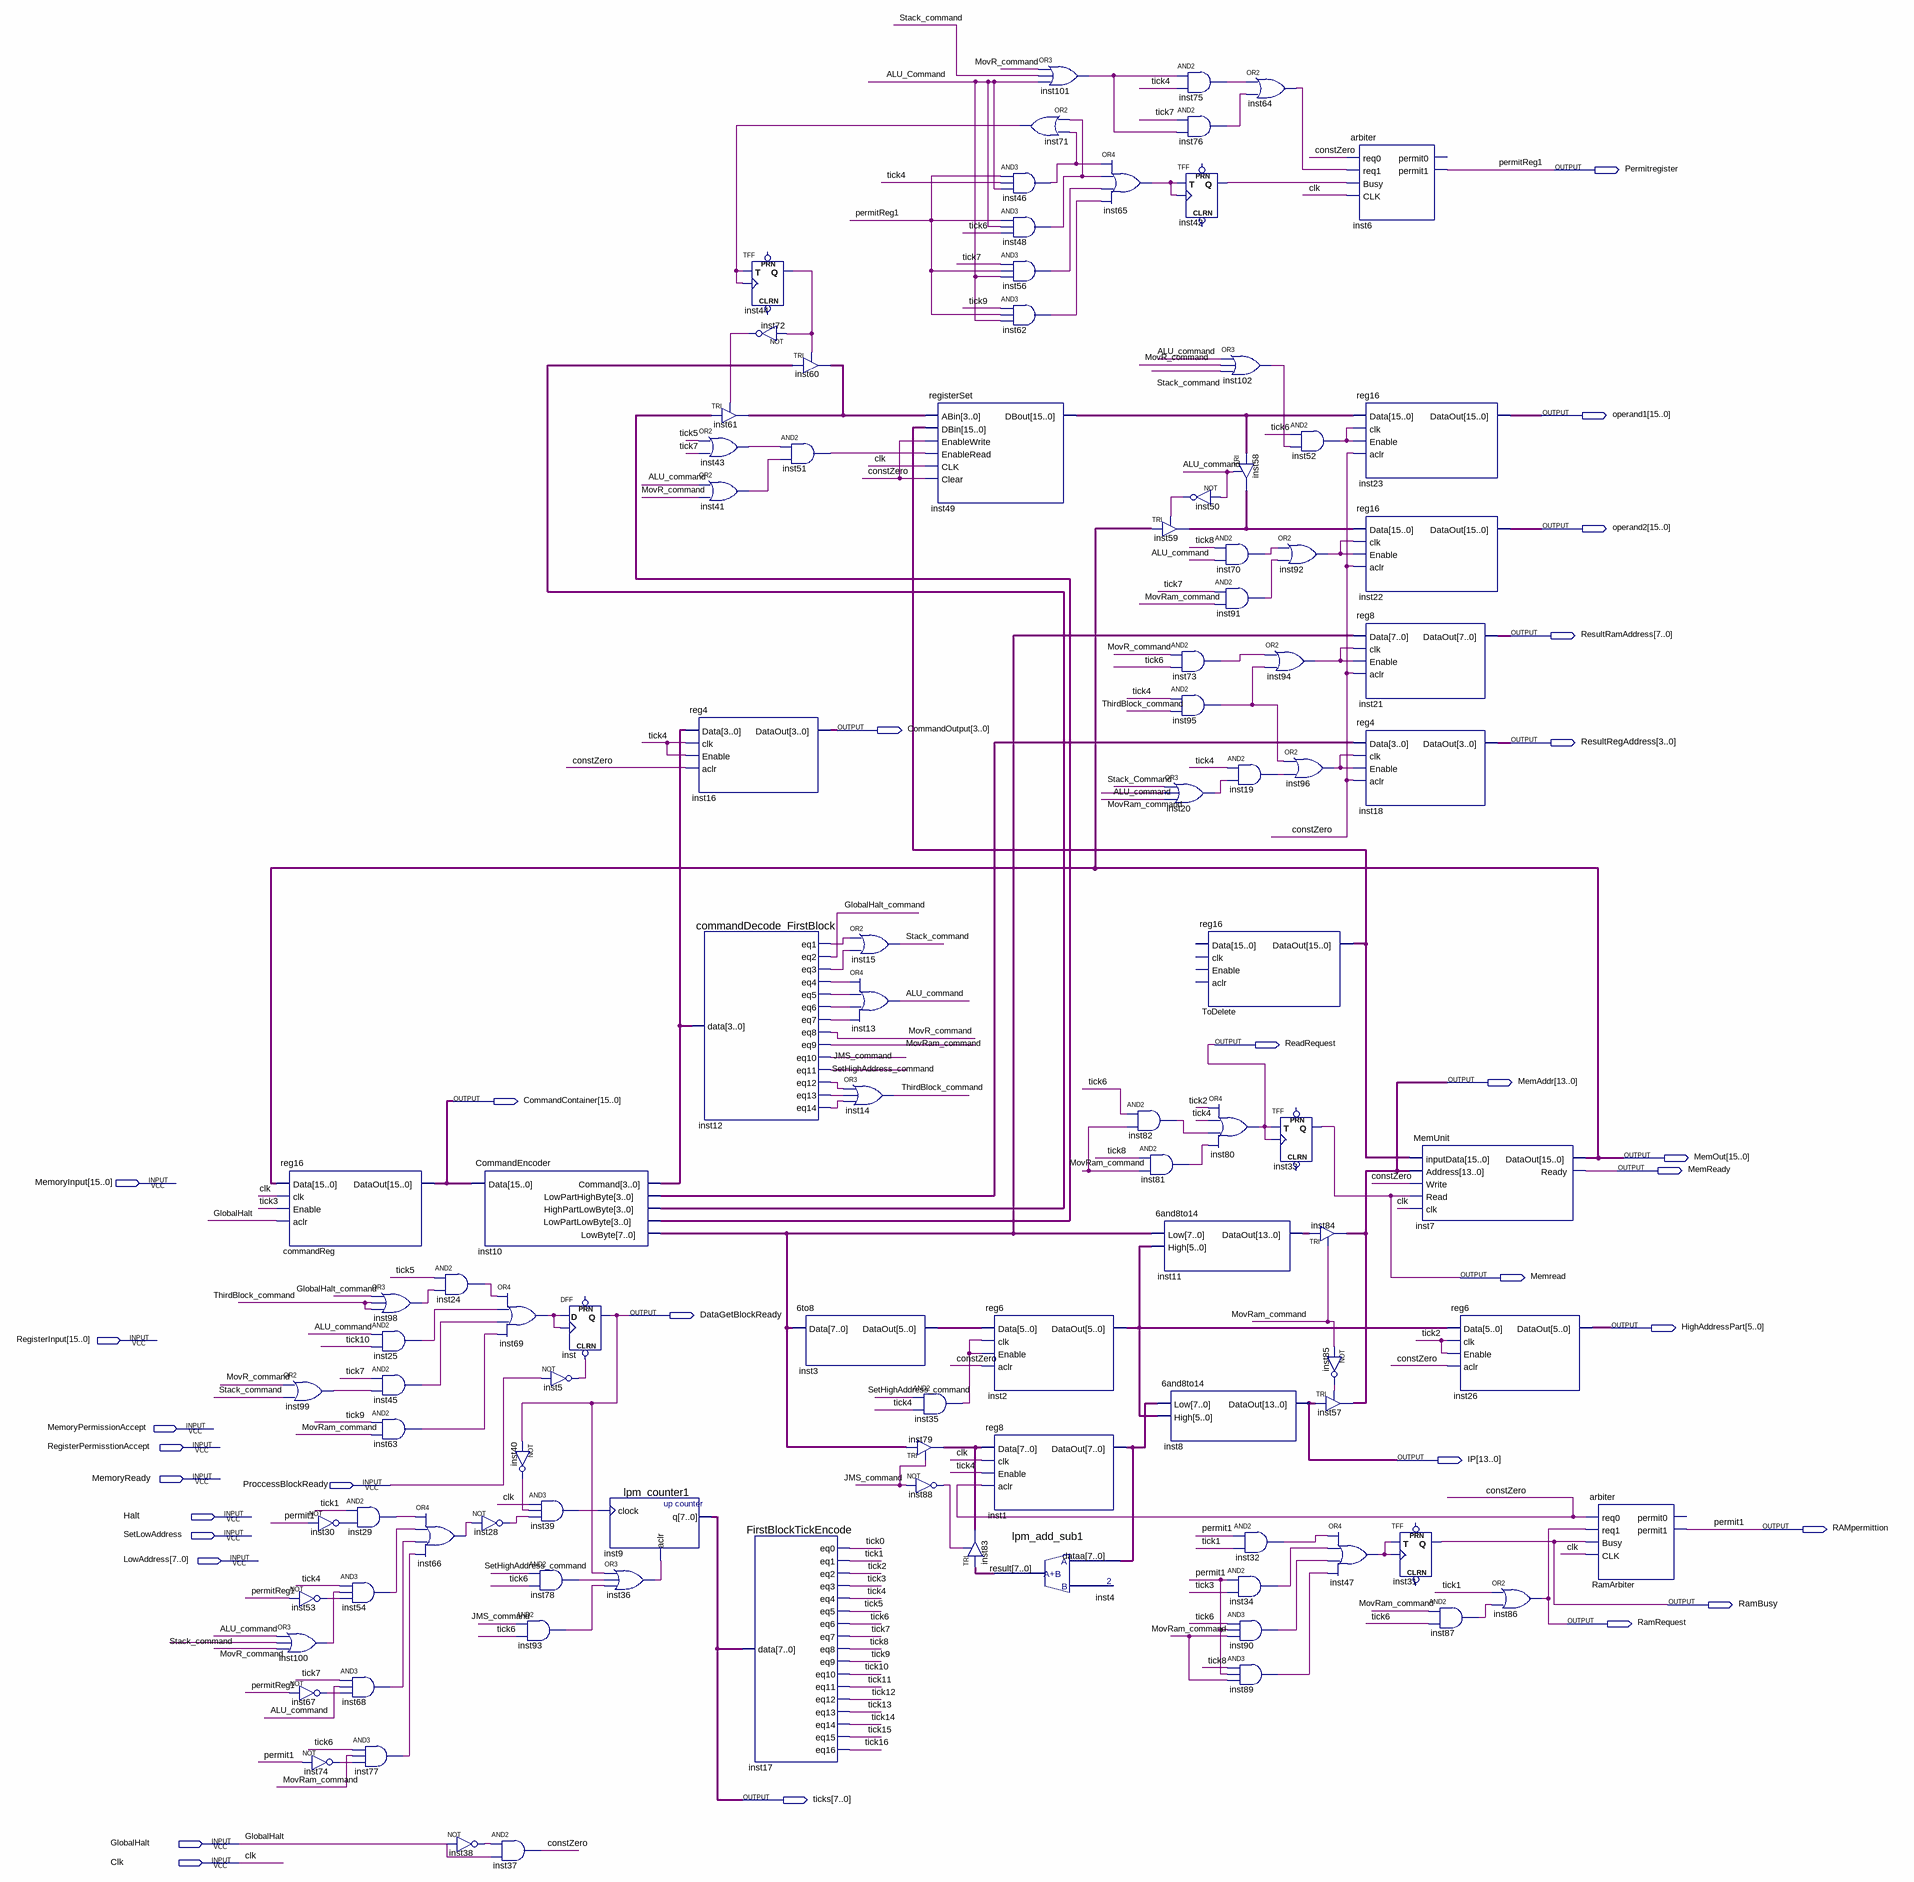
[diagram p0: schematic sheet]
// Quartus schematic DataGetBlock.bdf as structural Verilog: 103 symbols, 30 pins
module DataGetBlock (
  input  [15:0] MemoryInput,
  input  [15:0] RegisterInput,
  input  MemoryPermissionAccept,
  input  RegisterPermisstionAccept,
  input  MemoryReady,
  input  ProccessBlockReady,
  input  Halt,
  input  SetLowAddress,
  input  [7:0] LowAddress,
  input  GlobalHalt,
  input  Clk,
  output Permitregister,
  output [15:0] operand1,
  output [15:0] operand2,
  output [7:0] ResultRamAddress,
  output [3:0] CommandOutput,
  output [3:0] ResultRegAddress,
  output ReadRequest,
  output [13:0] MemAddr,
  output [15:0] CommandContainer,
  output [15:0] MemOut,
  output MemReady,
  output Memread,
  output DataGetBlockReady,
  output [5:0] HighAddressPart,
  output [13:0] IP,
  output RAMpermittion,
  output RamBusy,
  output RamRequest,
  output [7:0] ticks
);

  wire ALU_command, constZero, GlobalHalt_command, inst5_out, inst12_eq1, inst12_eq3, inst12_eq4, inst12_eq5,
       inst12_eq6, inst12_eq7, inst12_eq12, inst12_eq13, inst12_eq14, inst19_out, inst20_out, inst24_out,
       inst25_out, inst28_out, inst29_out, inst30_out, inst32_out, inst34_out, inst35_out, inst36_out,
       inst38_out, inst39_out, inst40_out, inst41_out, inst42_q, inst43_out, inst44_q, inst45_out,
       inst46_out, inst47_out, inst48_out, inst50_out, inst51_out, inst52_out, inst53_out, inst54_out,
       inst56_out, inst62_out, inst63_out, inst64_out, inst65_out, inst66_out, inst67_out, inst68_out,
       inst69_out, inst70_out, inst71_out, inst72_out, inst73_out, inst74_out, inst75_out, inst76_out,
       inst77_out, inst78_out, inst81_out, inst82_out, inst85_out, inst87_out, inst88_out, inst89_out,
       inst90_out, inst91_out, inst92_out, inst93_out, inst94_out, inst95_out, inst96_out, inst98_out,
       inst99_out, inst100_out, inst101_out, inst102_out, JMS_command, MovR_command, MovRam_command,
       SetHighAddress_command, Stack_command, ThirdBlock_command, tick0, tick1, tick2, tick3, tick4, tick5,
       tick6, tick7, tick8, tick9, tick10, tick11, tick12, tick13, tick14, tick15, tick16;
  wire [3:0] inst10_command, inst10_highpartlowbyte, inst10_lowparthighbyte, inst10_lowpartlowbyte,
       inst61_out;
  wire [5:0] inst2_dataout, inst3_dataout;
  wire [7:0] inst1_dataout, inst4_result, inst10_lowbyte, inst79_out;
  wire [13:0] inst11_dataout;
  wire [15:0] inst49_dbout, inst59_out, ToDelete_dataout;

  reg16 commandReg (.Data(MemOut), .clk(Clk), .Enable(tick3), .aclr(GlobalHalt), .DataOut(CommandContainer));
  or inst99 (inst99_out, MovR_command, Stack_command);
  not inst30 (inst30_out, RAMpermittion);
  not inst53 (inst53_out, Permitregister);
  or inst100 (inst100_out, ALU_command, Stack_command, MovR_command);
  not inst67 (inst67_out, Permitregister);
  not inst74 (inst74_out, RAMpermittion);
  or inst98 (inst98_out, GlobalHalt_command, ThirdBlock_command, ThirdBlock_command);
  and inst25 (inst25_out, ALU_command, tick10);
  and inst45 (inst45_out, tick7, inst99_out);
  and inst63 (inst63_out, tick9, MovRam_command);
  and inst29 (inst29_out, tick1, inst30_out);
  and inst54 (inst54_out, tick4, inst100_out, inst53_out);
  and inst68 (inst68_out, tick7, ALU_command, inst67_out);
  and inst77 (inst77_out, tick6, MovRam_command, inst74_out);
  or inst66 (inst66_out, inst29_out, inst54_out, inst68_out, inst77_out);
  CommandEncoder inst10 (
    .Data(CommandContainer), .Command(inst10_command), .LowPartHighByte(inst10_lowparthighbyte),
    .HighPartLowByte(inst10_highpartlowbyte), .LowPartLowByte(inst10_lowpartlowbyte), .LowByte(inst10_lowbyte));
  and inst24 (inst24_out, tick5, inst98_out);
  not inst28 (inst28_out, inst66_out);
  not inst38 (inst38_out, GlobalHalt);
  or inst69 (inst69_out, inst24_out, inst25_out, inst45_out, inst63_out);
  not inst40 (inst40_out, DataGetBlockReady);
  and inst93 (inst93_out, JMS_command, tick6);
  and inst37 (constZero, inst38_out, GlobalHalt);
  DFF inst (.CLRN(inst5_out), .CLK(inst69_out), .D(inst69_out), .Q(DataGetBlockReady));  // open: PRN
  not inst5 (inst5_out, ProccessBlockReady);
  and inst39 (inst39_out, Clk, inst40_out, inst28_out);
  and inst78 (inst78_out, SetHighAddress_command, tick6);
  lpm_counter1 inst9 (.clock(inst39_out), .aclr(inst36_out), .q(ticks));
  or inst36 (inst36_out, DataGetBlockReady, inst78_out, inst93_out);
  TRI inst61[3:0] (.IN(inst10_lowpartlowbyte), .OE(inst72_out), .OUT(inst61_out));
  or inst43 (inst43_out, tick5, tick7);
  or inst41 (inst41_out, ALU_command, MovR_command);
  reg4 inst16 (.Data(inst10_command), .clk(tick4), .Enable(tick4), .aclr(constZero), .DataOut(CommandOutput));
  commandDecode_FirstBlock inst12 (
    .data(inst10_command), .eq1(inst12_eq1), .eq2(GlobalHalt_command), .eq3(inst12_eq3), .eq4(inst12_eq4),
    .eq5(inst12_eq5), .eq6(inst12_eq6), .eq7(inst12_eq7), .eq8(MovR_command), .eq9(MovRam_command),
    .eq10(JMS_command), .eq11(SetHighAddress_command), .eq12(inst12_eq12), .eq13(inst12_eq13),
    .eq14(inst12_eq14));
  TFF inst44 (.T(inst71_out), .CLK(inst71_out), .Q(inst44_q));  // open: PRN, CLRN
  not inst72 (inst72_out, inst44_q);
  FirstBlockTickEncode inst17 (
    .data(ticks), .eq0(tick0), .eq1(tick1), .eq2(tick2), .eq3(tick3), .eq4(tick4), .eq5(tick5), .eq6(tick6),
    .eq7(tick7), .eq8(tick8), .eq9(tick9), .eq10(tick10), .eq11(tick11), .eq12(tick12), .eq13(tick13),
    .eq14(tick14), .eq15(tick15), .eq16(tick16));
  TRI inst60[3:0] (.IN(inst10_highpartlowbyte), .OE(inst44_q), .OUT(inst61_out));
  and inst51 (inst51_out, inst43_out, inst41_out);
  \6to8  inst3 (.Data(inst10_lowbyte), .DataOut(inst3_dataout));
  or inst15 (Stack_command, inst12_eq1, inst12_eq3);
  or inst13 (ALU_command, inst12_eq4, inst12_eq5, inst12_eq6, inst12_eq7);
  or inst14 (ThirdBlock_command, inst12_eq12, inst12_eq13, inst12_eq14);
  registerSet inst49 (
    .ABin(inst61_out), .DBin(ToDelete_dataout), .EnableWrite(constZero), .EnableRead(inst51_out), .CLK(Clk),
    .Clear(constZero), .DBout(inst49_dbout));
  and inst35 (inst35_out, SetHighAddress_command, tick4);
  TRI inst79[7:0] (.IN(inst10_lowbyte), .OE(JMS_command), .OUT(inst79_out));
  not inst88 (inst88_out, JMS_command);
  TRI inst83[7:0] (.IN(inst4_result), .OE(inst88_out), .OUT(inst79_out));
  or inst71 (inst71_out, inst48_out, inst46_out);
  and inst46 (inst46_out, Permitregister, tick4, ALU_command);
  and inst48 (inst48_out, Permitregister, ALU_command, tick6);
  and inst56 (inst56_out, tick7, Permitregister, ALU_command);
  and inst62 (inst62_out, tick9, Permitregister, ALU_command);
  reg6 inst2 (.Data(inst3_dataout), .clk(inst35_out), .Enable(inst35_out), .aclr(constZero), .DataOut(inst2_dataout));
  reg8 inst1 (.Data(inst79_out), .clk(Clk), .Enable(tick4), .aclr(constZero), .DataOut(inst1_dataout));
  lpm_add_sub1 inst4 (.dataa(inst1_dataout), .result(inst4_result));
  or inst101 (inst101_out, MovR_command, Stack_command, ALU_command);
  or inst65 (inst65_out, inst46_out, inst48_out, inst56_out, inst62_out);
  and inst82 (inst82_out, tick6, MovRam_command);
  and inst75 (inst75_out, inst101_out, tick4);
  and inst76 (inst76_out, tick7, inst101_out);
  TFF inst42 (.T(inst65_out), .CLK(inst65_out), .Q(inst42_q));  // open: PRN, CLRN
  TRI inst59[15:0] (.IN(MemOut), .OE(inst50_out), .OUT(inst59_out));
  and inst73 (inst73_out, MovR_command, tick6);
  and inst95 (inst95_out, tick4, ThirdBlock_command);
  or inst20 (inst20_out, Stack_command, ALU_command, MovRam_command);
  and inst81 (inst81_out, tick8, MovRam_command);
  \6and8to14  inst11 (.Low(inst10_lowbyte), .High(inst2_dataout), .DataOut(inst11_dataout));
  \6and8to14  inst8 (.Low(inst1_dataout), .High(inst2_dataout), .DataOut(IP));
  or inst102 (inst102_out, ALU_command, MovR_command, Stack_command);
  not inst50 (inst50_out, ALU_command);
  and inst70 (inst70_out, tick8, ALU_command);
  and inst91 (inst91_out, tick7, MovRam_command);
  and inst19 (inst19_out, tick4, inst20_out);
  reg16 ToDelete (.DataOut(ToDelete_dataout));  // open: Data, clk, Enable, aclr
  or inst80 (ReadRequest, tick2, tick4, inst82_out, inst81_out);
  and inst34 (inst34_out, RAMpermittion, tick3);
  and inst90 (inst90_out, tick6, RAMpermittion, MovRam_command);
  and inst89 (inst89_out, tick8, RAMpermittion, MovRam_command);
  or inst64 (inst64_out, inst75_out, inst76_out);
  TRI inst58[15:0] (.IN(inst49_dbout), .OE(ALU_command), .OUT(inst59_out));
  or inst92 (inst92_out, inst70_out, inst91_out);
  or inst94 (inst94_out, inst73_out, inst95_out);
  TFF inst33 (.T(ReadRequest), .CLK(ReadRequest), .Q(Memread));  // open: PRN, CLRN
  and inst32 (inst32_out, RAMpermittion, tick1);
  and inst52 (inst52_out, tick6, inst102_out);
  or inst96 (inst96_out, inst95_out, inst19_out);
  TRI inst84[13:0] (.IN(inst11_dataout), .OE(MovRam_command), .OUT(MemAddr));
  not inst85 (inst85_out, MovRam_command);
  TRI inst57[13:0] (.IN(IP), .OE(inst85_out), .OUT(MemAddr));
  or inst47 (inst47_out, inst32_out, inst34_out, inst90_out, inst89_out);
  arbiter inst6 (
    .req0(constZero), .req1(inst64_out), .Busy(inst42_q), .CLK(Clk), .permit1(Permitregister));  // open: permit0
  reg16 inst23 (.Data(inst49_dbout), .clk(inst52_out), .Enable(inst52_out), .aclr(constZero), .DataOut(operand1));
  reg16 inst22 (.Data(inst59_out), .clk(inst92_out), .Enable(inst92_out), .aclr(constZero), .DataOut(operand2));
  reg8 inst21 (
    .Data(inst10_lowbyte), .clk(inst94_out), .Enable(inst94_out), .aclr(constZero), .DataOut(ResultRamAddress));
  reg4 inst18 (
    .Data(inst10_lowparthighbyte), .clk(inst96_out), .Enable(inst96_out), .aclr(constZero),
    .DataOut(ResultRegAddress));
  MemUnit inst7 (
    .inputData(ToDelete_dataout), .Address(MemAddr), .Write(constZero), .Read(Memread), .clk(Clk),
    .DataOut(MemOut), .Ready(MemReady));
  TFF inst31 (.T(inst47_out), .CLK(inst47_out), .Q(RamBusy));  // open: PRN, CLRN
  and inst87 (inst87_out, MovRam_command, tick6);
  reg6 inst26 (.Data(inst2_dataout), .clk(tick2), .Enable(tick2), .aclr(constZero), .DataOut(HighAddressPart));
  or inst86 (RamRequest, tick1, inst87_out);
  arbiter RamArbiter (
    .req0(constZero), .req1(RamRequest), .Busy(RamBusy), .CLK(Clk), .permit1(RAMpermittion));  // open: permit0

  // Other names for the same wires on the sheet: permit1 = RAMpermittion; permitReg1 = Permitregister
endmodule
